# EAGLE design Programmer_HCS (EAGLE 9.5.1)

## Sheet 1 of 2
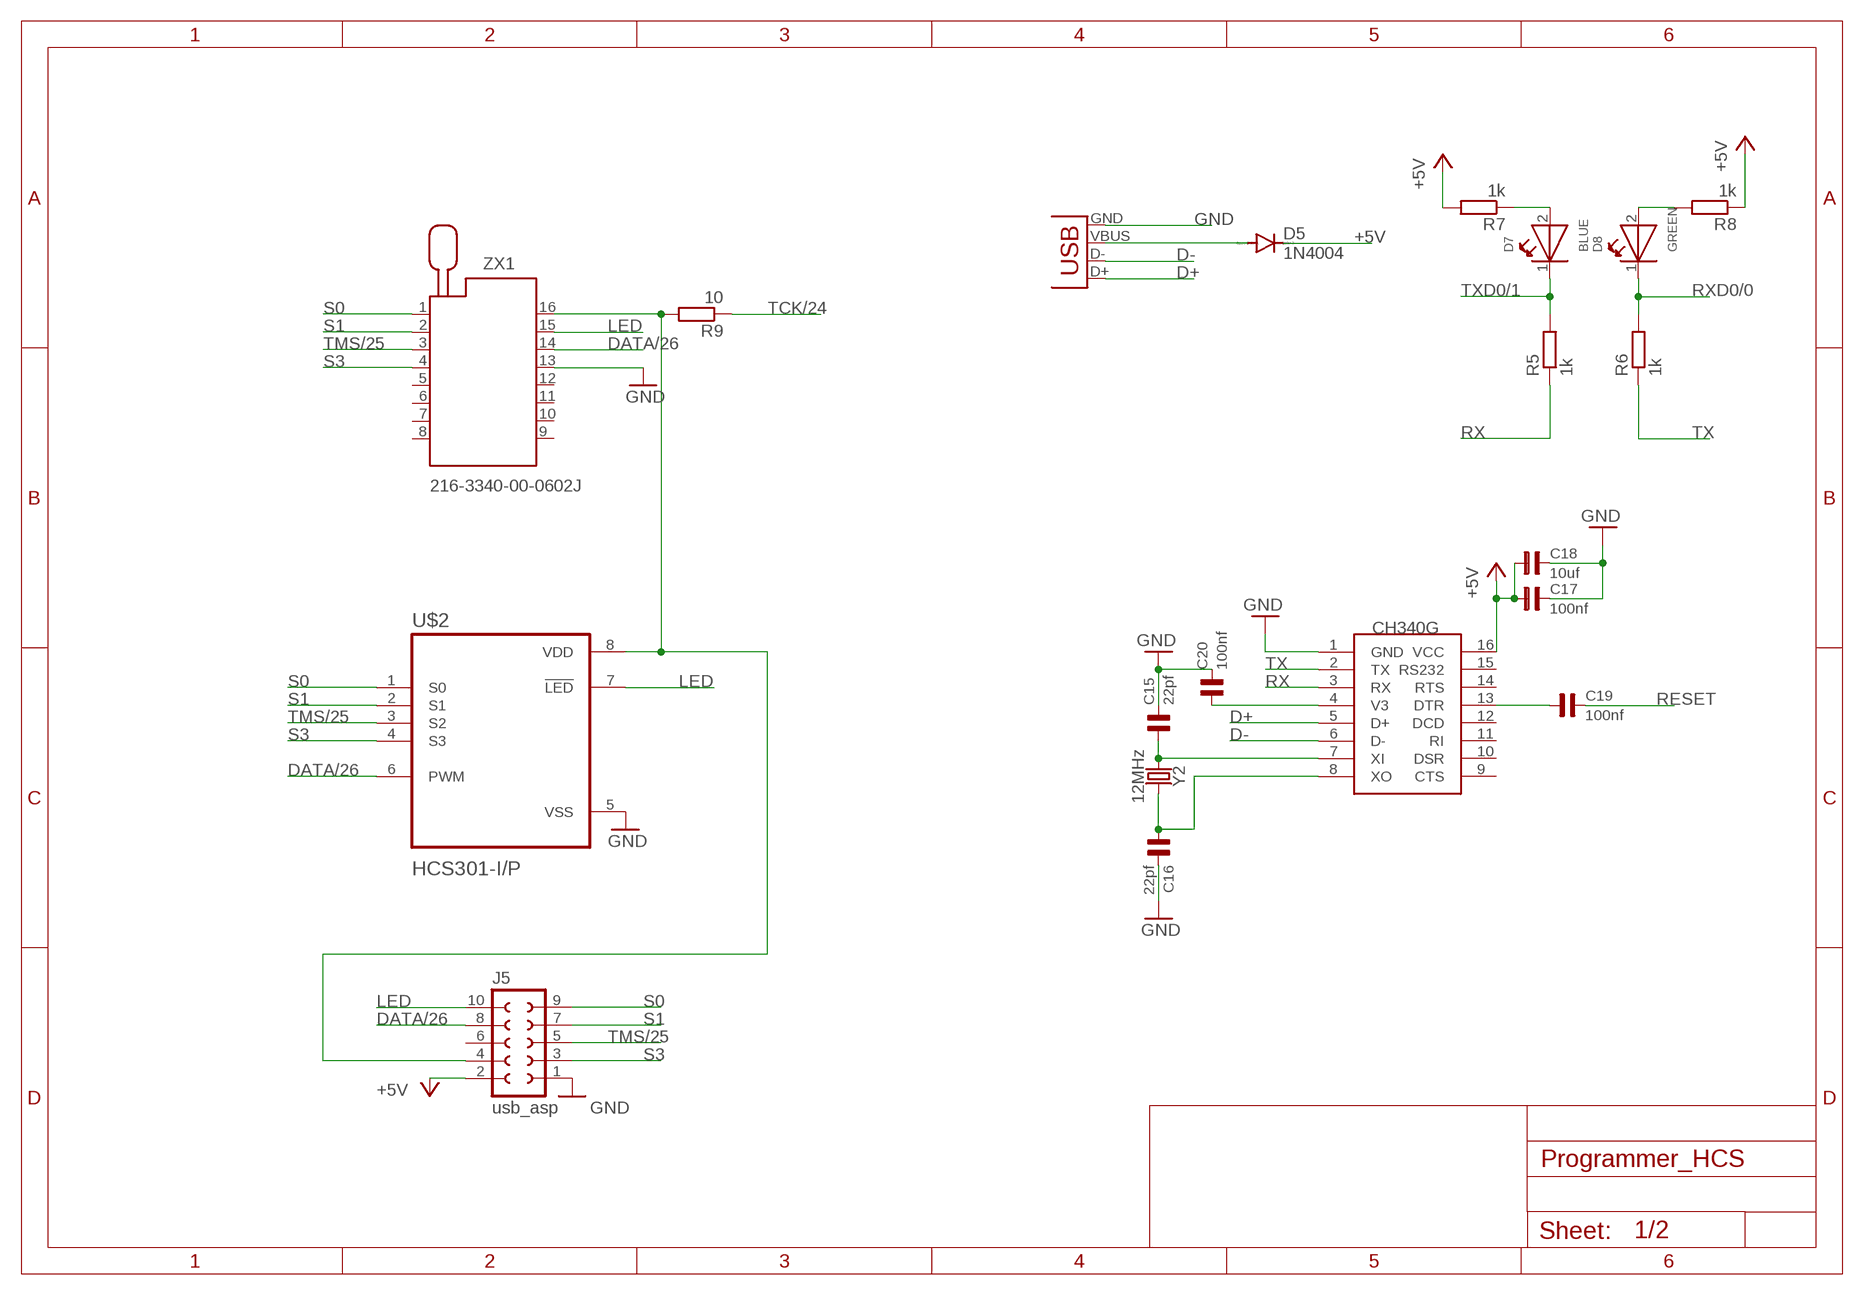
[diagram p0: schematic, sheet 1]

### Parts
C15  22pf  C0805  [0805]
C16  22pf  C0805  [0805]
C17  100nf  C0805  [0805]
C18  10uf  C0805  [0805]
C19  100nf  C0805  [0805]
C20  100nf  C0805  [0805]
D5  1N4004  DIODE-DO214AA  [DO214AA]
D7  BLUE  WL-SMCW-150080RS75000-R  [0805]
D8  GREEN  WL-SMCW-150080RS75000-R  [0805]
J5  usb_asp  SOCKET-10V  [S10V]
R5  1k  R-EU_R0805  [R0805]
R6  1k  R-EU_R0805  [R0805]
R7  1k  R-EU_R0805  [R0805]
R8  1k  R-EU_R0805  [R0805]
R9  10  R-EU_R0805  [R0805]
U$1  CH340G  [SOIC16]
U$2  HCS301-I/P  [DIP787W46P254L927H533Q8]
X1  USB-B-H  [USB-B-H]
Y2  12MHz  CRYSTAL-16MHZPTH-HC49US  [HC49US]
ZX1  216-3340-00-0602J  [216-3340-00-0602J]

### Nets
+5V: C17.1 C18.1 D5.C J5.2 R7.2 R8.1 U$1.16(VCC) ; also sheet 2
D+: U$1.5(D+) X1.D+
D-: U$1.6(D-) X1.D-
DATA/26: J5.8 U$2.6(PWM) ZX1.14 ; also sheet 2
GND: C15.2 C16.2 C17.2 C18.2 C20.2 J5.1 U$1.1(GND) U$2.5(VSS) X1.GND ZX1.13 ; also sheet 2
LED: J5.10 U$2.7(!LED) ZX1.15
N$4: C15.1 U$1.7(XI) Y2.1
N$5: C16.1 U$1.8(XO) Y2.2
N$6: D8.2(A) R8.2
N$7: D5.A X1.VBUS
N$8: C19.1 U$1.13(DTR)
N$9: D7.2(A) R7.1
N$10: C20.1 U$1.4(V3)
N$11: J5.4 R9.2 U$2.8(VDD) ZX1.16
RESET: C19.2 ; also sheet 2
RX: R5.1 U$1.3(RX)
RXD0/0: D8.1(K) R6.2 ; also sheet 2
S0: J5.9 U$2.1(S0) ZX1.1
S1: J5.7 U$2.2(S1) ZX1.2
S3: J5.3 U$2.4(S3) ZX1.4
TCK/24: R9.1 ; also sheet 2
TMS/25: J5.5 U$2.3(S2) ZX1.3 ; also sheet 2
TX: R6.1 U$1.2(TX)
TXD0/1: D7.1(K) R5.2 ; also sheet 2
Unconnected: J5.6 U$1.9(CTS) U$1.10(DSR) U$1.11(RI) U$1.12(DCD) U$1.14(RTS) U$1.15(RS232) ZX1.5 ZX1.6 ZX1.7 ZX1.8 ZX1.9 ZX1.10 ZX1.11 ZX1.12

## Sheet 2 of 2
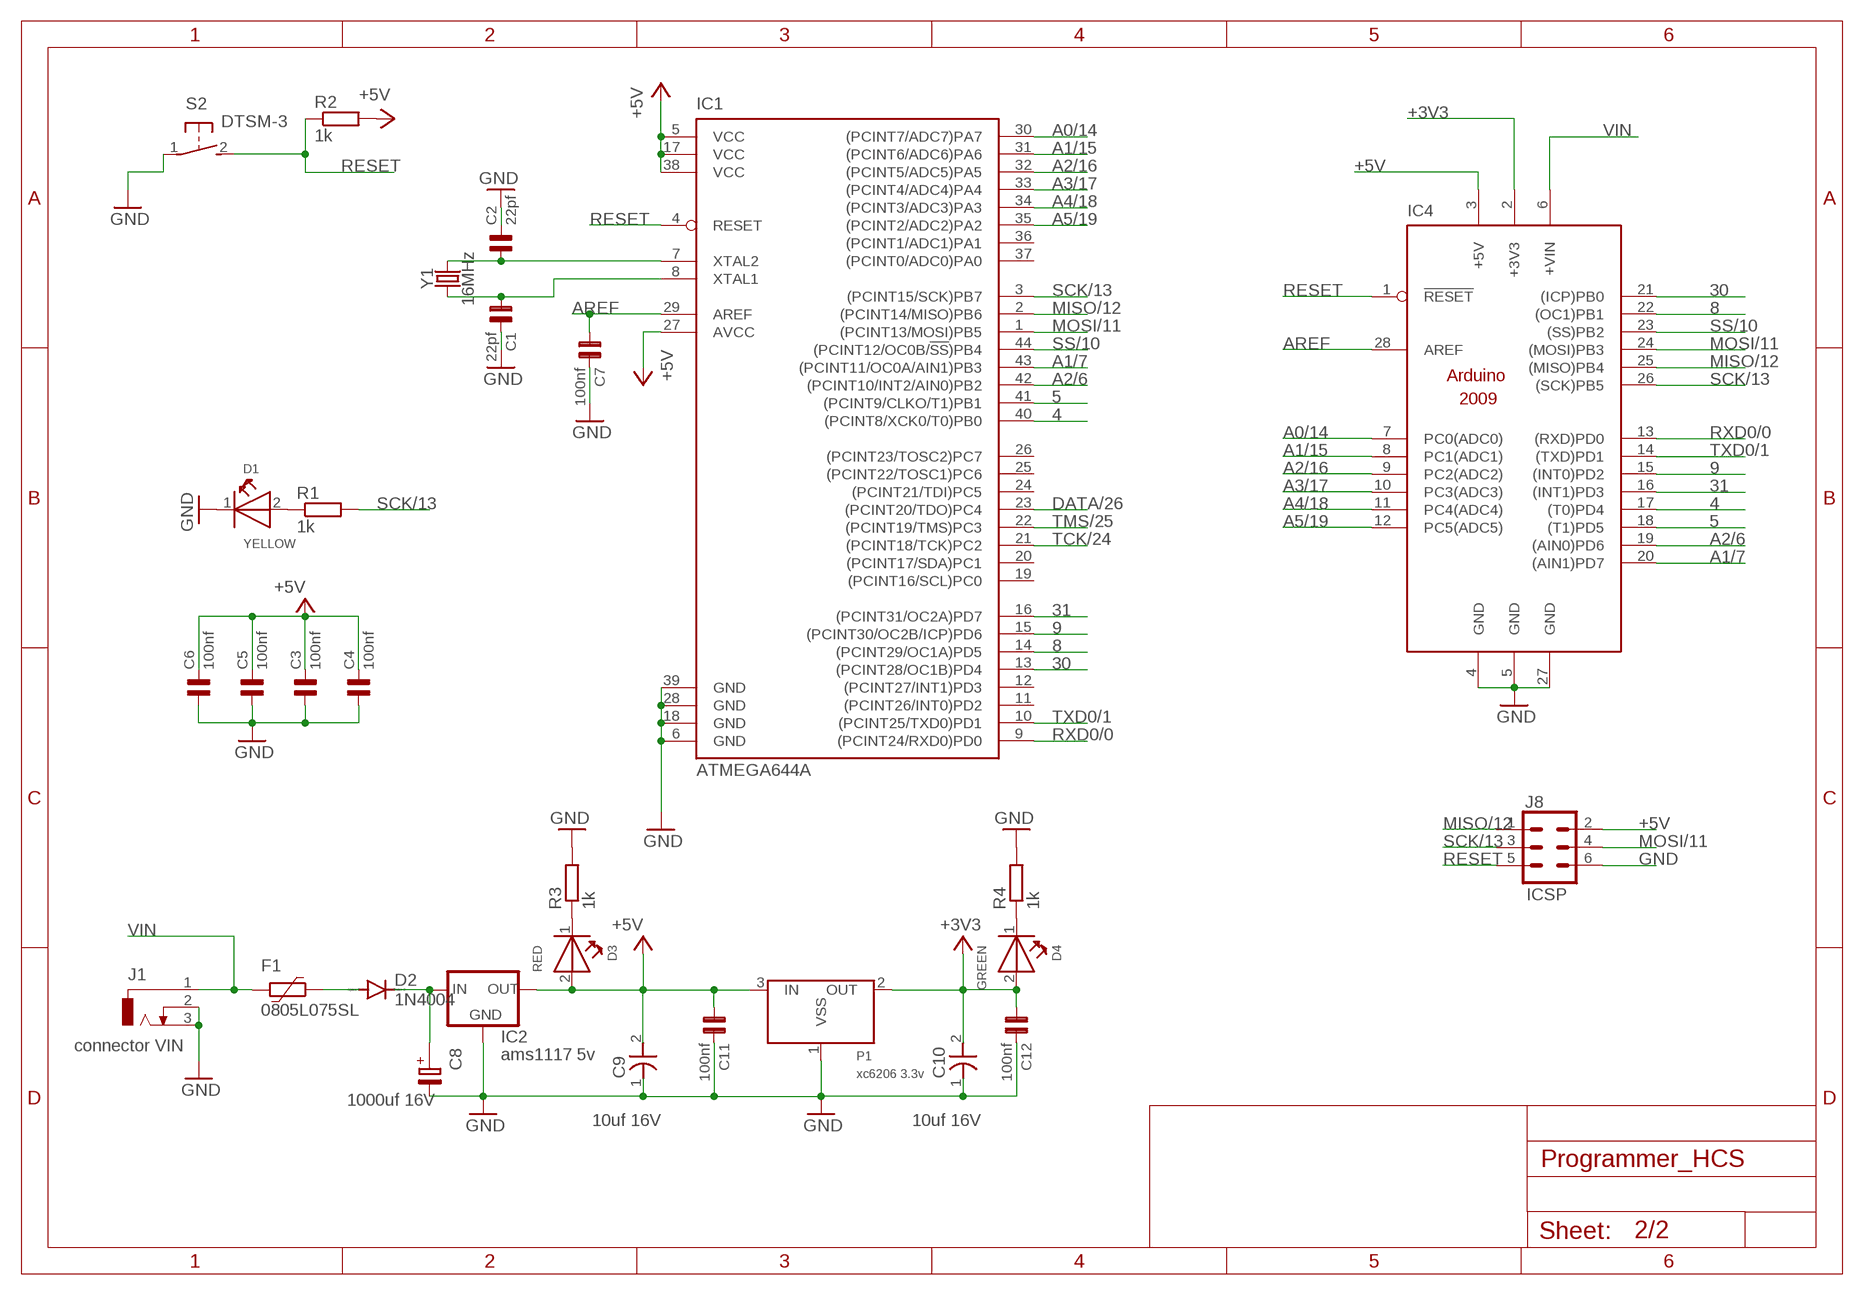
[diagram p1: schematic, sheet 2]

### Parts
C1  22pf  C0805  [0805]
C2  22pf  C0805  [0805]
C3  100nf  C0805  [0805]
C4  100nf  C0805  [0805]
C5  100nf  C0805  [0805]
C6  100nf  C0805  [0805]
C7  100nf  C0805  [0805]
C8  1000uf 16V  C-PR-SMD-SV-G  [SV-G]
C9  10uf 16V  CP6032  [6032]
C10  10uf 16V  CP6032  [6032]
C11  100nf  C0805  [0805]
C12  100nf  C0805  [0805]
D1  YELLOW  WL-SMTW-150141AS73100-A  [3528-2PIN]
D2  1N4004  DIODE-DO-214AC  [DO-214AC]
D3  RED  WL-SMTW-150141AS73100-A  [3528-2PIN]
D4  GREEN  WL-SMTW-150141AS73100-A  [3528-2PIN]
F1  0805L075SL  [0805L]
IC1  ATMEGA644A  [TQFP44]
IC2  ams1117 5v  LM1117  [SOT223]
IC4  UNO  ARDUINO2009_PIN_10  [ARDUINO2009]
J1  connector VIN  DCJ0303  [DCJ0303]
J8  ICSP  CONN_03X2FEMALE  [2X3]
P1  xc6206 3.3v  XC6206SOT-23  [XC6206_SOT-23]
R1  1k  R-EU_R0805  [R0805]
R2  1k  R-EU_R0805  [R0805]
R3  1k  R-EU_R0805  [R0805]
R4  1k  R-EU_R0805  [R0805]
S2  DTSM-3  [DTSM-3]
Y1  16MHz  CRYSTAL-16MHZPTH-HC49US  [HC49US]

### Nets
4: IC1.40((PCINT8/XCK0/T0)PB0) IC4.17((T0)PD4)
5: IC1.41((PCINT9/CLKO/T1)PB1) IC4.18((T1)PD5)
8: IC1.14((PCINT29/OC1A)PD5) IC4.22((OC1)PB1)
9: IC1.15((PCINT30/OC2B/ICP)PD6) IC4.15((INT0)PD2)
30: IC1.13((PCINT28/OC1B)PD4) IC4.21((ICP)PB0)
31: IC1.16((PCINT31/OC2A)PD7) IC4.16((INT1)PD3)
+3V3: C10.2(+) C12.1 D4.2(A) IC4.2(+3V3) P1.2(OUT)
+5V: C3.2 C4.2 C5.2 C6.2 C9.2(+) C11.1 D3.2(A) IC1.5(VCC) IC1.17(VCC) IC1.27(AVCC) IC1.38(VCC) IC2.2(OUT) IC4.3(+5V) J8.2 P1.3(IN) R2.2 ; also sheet 1
A0/14: IC1.30((PCINT7/ADC7)PA7) IC4.7(PC0(ADC0))
A1/7: IC1.43((PCINT11/OC0A/AIN1)PB3) IC4.20((AIN1)PD7)
A1/15: IC1.31((PCINT6/ADC6)PA6) IC4.8(PC1(ADC1))
A2/6: IC1.42((PCINT10/INT2/AIN0)PB2) IC4.19((AIN0)PD6)
A2/16: IC1.32((PCINT5/ADC5)PA5) IC4.9(PC2(ADC2))
A3/17: IC1.33((PCINT4/ADC4)PA4) IC4.10(PC3(ADC3))
A4/18: IC1.34((PCINT3/ADC3)PA3) IC4.11(PC4(ADC4))
A5/19: IC1.35((PCINT2/ADC2)PA2) IC4.12(PC5(ADC5))
AREF: C7.1 IC1.29(AREF) IC4.28(AREF)
DATA/26: IC1.23((PCINT20/TDO)PC4) ; also sheet 1
GND: C1.2 C2.2 C3.1 C4.1 C5.1 C6.1 C7.2 C8.- C9.1(-) C10.1(-) C11.2 C12.2 D1.1(K) IC1.6(GND) IC1.18(GND) IC1.28(GND) IC1.39(GND) IC2.1(GND) IC4.4(GND) IC4.5(GND) IC4.27(GND) J1.2 J1.3 J8.6 P1.1(VSS) R3.2 R4.2 S2.1 ; also sheet 1
MISO/12: IC1.2((PCINT14/MISO)PB6) IC4.25((MISO)PB4) J8.1
MOSI/11: IC1.1((PCINT13/MOSI)PB5) IC4.24((MOSI)PB3) J8.4
N$1: C2.1 IC1.7(XTAL2) Y1.2
N$2: C1.1 IC1.8(XTAL1) Y1.1
N$3: D1.2(A) R1.1
N$24: C8.+ D2.C IC2.3(IN)
N$44: D3.1(K) R3.1
N$45: D2.A F1.1
N$46: D4.1(K) R4.1
RESET: IC1.4(RESET) IC4.1(!RESET) J8.5 R2.1 S2.2 ; also sheet 1
RXD0/0: IC1.9((PCINT24/RXD0)PD0) IC4.13((RXD)PD0) ; also sheet 1
SCK/13: IC1.3((PCINT15/SCK)PB7) IC4.26((SCK)PB5) J8.3 R1.2
SS/10: IC1.44((PCINT12/OC0B/!SS!)PB4) IC4.23((SS)PB2)
TCK/24: IC1.21((PCINT18/TCK)PC2) ; also sheet 1
TMS/25: IC1.22((PCINT19/TMS)PC3) ; also sheet 1
TXD0/1: IC1.10((PCINT25/TXD0)PD1) IC4.14((TXD)PD1) ; also sheet 1
VIN: F1.2 IC4.6(+VIN) J1.1
Unconnected: IC1.11((PCINT26/INT0)PD2) IC1.12((PCINT27/INT1)PD3) IC1.19((PCINT16/SCL)PC0) IC1.20((PCINT17/SDA)PC1) IC1.24((PCINT21/TDI)PC5) IC1.25((PCINT22/TOSC1)PC6) IC1.26((PCINT23/TOSC2)PC7) IC1.36((PCINT1/ADC1)PA1) IC1.37((PCINT0/ADC0)PA0)

## Library data of the parts
C1-C7 C11 C12 C15-C20 = capsmd:C0805
C8 = cap-pan40:C-PR: POLARIZED ELECTROLYTIC/TANTALUM
C9 C10 = capsmd:CP6032
D1 D3 D4 = Wurth_Elektronik_Optoelectronics_rev15b(1):WL-SMTW: SMD Side view mono-color round Characteristics Low power consumption High reliability Low current requirement No UV/IR radiation Wide viewing angle Excelllent for edge lighting displays and backlighting indicators Ideal for miniature applications PBC high-usage Compatible with automatic placement equipment Applications Backlighting for LCD Sidelighting applications Indicator and backlighting for telecommunication Backlighting for symbol, switch and dashboard General use <http://katalog.we-online.de/media/images/eipal/WL-SMTW_pf2.jpg> Details see: http://katalog.we-online.de/en/led/WL-SMTW?m Updated: 2015-04-10 2015 (C) Wurth Elektronik; COMPANY-URL: http://www.we-online.de; CREATED-BY: Christin Otto; CREATED-DATE: APR 2013; DATASHEET-URL: http://katalog.we-online.de/en/led/WL-SMTW?m=t&sq=smtw&sp=&sp=http%3A%2F%2Fwww.we-online.de%2Fweb%2Fen%2Felectronic_components%2Fsearchpage_PBS.php%3Fsearch%3Dsmtw; MANUFACTURER: Würth Elektronik eiSos GmbH
D2 D5 = diode:DIODE-: DIODE
D7 D8 = Wurth_Elektronik_Optoelectronics_rev15b(1):WL-SMCW: SMD mono-color Chip LED Characteristics Low energy consumption High reliability Low current requirement Fast switching No UV/IR radiation Smallest SMD package with exceptional brightness Top view Wide viewing angle PBC high-usage Applications Backlight for mobile and portable device keypads Indoor and outdoor message boards Flat backlight for LCDs, switches and symbols Display for industrial control systems and traffic Miniaturized color effects Pedestrian mark Optical indicators General lighting Toys <http://katalog.we-online.de/media/images/eipal/WL-SMCW_pf2.jpg> Details see: http://katalog.we-online.de/en/led/WL-SMCW?m Updated 2015-04-10 2015 (C) Wurth Elektronik; COMPANY-URL: http://www.we-online.de; CREATED-BY: Christin Otto; CREATED-DATE: APR 2013; DATASHEET-URL: http://katalog.we-online.de/en/led/WL-SMCW?m=t&sq=smcw&sp=&sp=http%3A%2F%2Fwww.we-online.de%2Fweb%2Fen%2Felectronic_components%2Fsearchpage_PBS.php%3Fsearch%3Dsmcw#vs_t2:2; MANUFACTURER: Würth Elektronik eiSos GmbH
F1 = polyfuse-smd_10:?: Polyfuse Resettable PTC Source: http://www.littelfuse.com/products/resettable-ptcs.aspx; MF: Littelfuse; MPN: 0805L075SL; OC_FARNELL: 2125905; OC_NEWARK: 88T7684
IC1 = atmel:ATMEGA644: 8-bit Microcontroller with 64K Bytes In-System Programmable Flash Source: http://www.atmel.com/dyn/resources/prod_documents/doc2593.pdf; MPN: ATMEGA644PV-10AU; OC_FARNELL: 1455123; OC_NEWARK: 58M3748
IC2 = v-reg-2:LM1117
IC4 = arduino:ARDUINO2009_PIN_1: The Arduino Duemilanove ("2009") is a microcontroller board based on the ATmega168 or ATmega328. - 14 digital input/output pins (of which 6 can be used as PWM outputs) - 6 analog inputs, a 16 MHz crystal oscillator - USB connection - power jack - ISP header - reset button It contains everything needed to support the microcontroller; simply connect it to a computer with a USB cable or power it with a AC-to-DC adapter or battery to get started http://arduino.cc/en/Main/ArduinoBoardDuemilanove
J1 = con-jack:DCJ0303: DC POWER JACK Source: DCJ0303.pdf; OC_FARNELL: unknown; OC_NEWARK: unknown
J5 = con-3m-skt-header:SOCKET-10: 10 pin PCB Socket (3m 85xx/51xx)
J8 = SparkFun-Connectors:CONN_03X2: Multi connection point. Often used as Generic Header-pin footprint for 0.1 inch spaced/style header connections You can populate with any combo of single row headers, but if you'd like an exact match, check these: Header - 2x3 (Male, 0.1") <https://www.sparkfun.com/products/12807> (PRT-12807) Header - 2x3 (Female, 0.1") <https://www.sparkfun.com/products/13010> (PRT-13010) 2x3 Pin Shrouded Header <https://www.sparkfun.com/products/10877> (PRT-10877) On any of the 0.1 inch spaced packages, you can populate with these: Break Away Headers - Straight <https://www.sparkfun.com/products/116> (PRT-00116) Break Away Male Headers - Right Angle <https://www.sparkfun.com/products/553> (PRT-00553) Female Headers <https://www.sparkfun.com/products/115> (PRT-00115) Break Away Headers - Machine Pin <https://www.sparkfun.com/products/117> (PRT-00117) Break Away Female Headers - Swiss Machine Pin <https://www.sparkfun.com/products/743> (PRT-00743) Special note: the shrouded connector mates well with our 3x2 ribbon cables: Ribbon Crimp Connector - 6-pin (2x3, Female) <https://www.sparkfun.com/products/10651> (PRT-10651) Ribbon Cable - 6 wire (15ft) <https://www.sparkfun.com/products/10646> (PRT-10646); PROD_ID: CONN-11566; VALUE: FEMALE 2x3
P1 = Voltage Regulator:XC6206: XC6206P , linear regulator. Producted by TOREX.Co Store Information: EXCEL device corporation http://www.excel-d.com/access/index.html
R1-R9 = resistor:R-EU_: RESISTOR, European symbol
S2 = switch-tact:DTSM-3
U$1 = ch340g:CH340G
U$2 = HCS301-I_P:HCS301-I/P: Check prices <https://pricing.snapeda.com/parts/HCS301-I/P/Microchip/view-part?ref=eda>; AVAILABILITY: Warning; DESCRIPTION: IC CODE HOPPING ENCODER 8DIP; MF: Microchip; MP: HCS301-I/P; PACKAGE: DIP-8 Microchip; PRICE: None; PURCHASE-URL: https://pricing.snapeda.com/search/part/HCS301-I/P/?ref=eda
X1 = con-usb:USB: USB Connectors
Y1 = SparkFun-Clocks:CRYSTAL-16MHZ: 16MHz Crystal Digikey Example <http://www.digikey.com/product-search/en?keywords=535-9122-1-ND> Frequency: 16MHz Frequency Stability: ±50ppm Frequency Tolerance: ±20ppm Load Capacitance: 18pF SparkFun Products: Pro Micro -5V/16MHz <https://www.sparkfun.com/products/12640> SparkFun Serial Enabled LCD Kit <https://www.sparkfun.com/products/10097>; PROD_ID: XTAL-08181; SF_ID: COM-00536
Y2 = SparkFun-Clocks:CRYSTAL-16MHZ: 16MHz Crystal Digikey Example <http://www.digikey.com/product-search/en?keywords=535-9122-1-ND> Frequency: 16MHz Frequency Stability: ±50ppm Frequency Tolerance: ±20ppm Load Capacitance: 18pF SparkFun Products: Pro Micro -5V/16MHz <https://www.sparkfun.com/products/12640> SparkFun Serial Enabled LCD Kit <https://www.sparkfun.com/products/10097>; PROD_ID: XTAL-08181; SF_ID: COM-00536; VALUE: 16MHz
ZX1 = 216-3340-00-0602J:216-3340-00-0602J: Zero Insertion Force Socked Source: http://www.3M.com/ehpd Check prices <https://pricing.snapeda.com/parts/216-3340-00-0602J/3M/view-part?ref=eda>; AVAILABILITY: Warning; DESCRIPTION: 16 (2 x 8) Pos DIP, ZIF (ZIP), 0.3 (7.62mm) Row Spacing Socket Gold Connector; MF: 3M; MP: 216-3340-00-0602J; PACKAGE: None; PRICE: None; PURCHASE-URL: https://pricing.snapeda.com/search/part/216-3340-00-0602J/?ref=eda

## Board
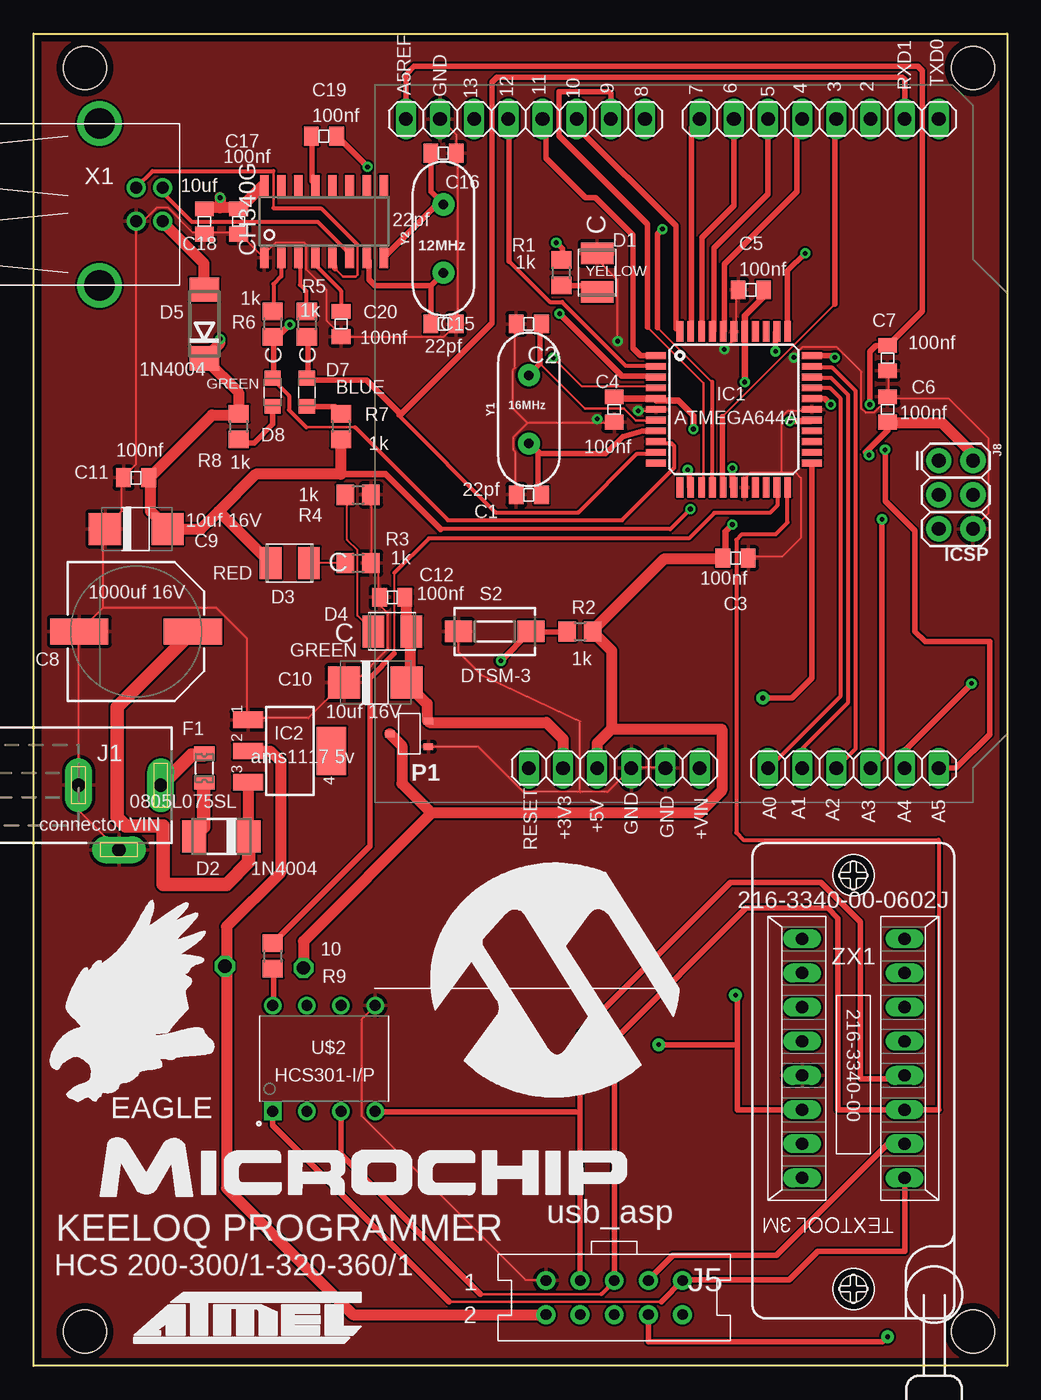
[diagram p2: board, top side]
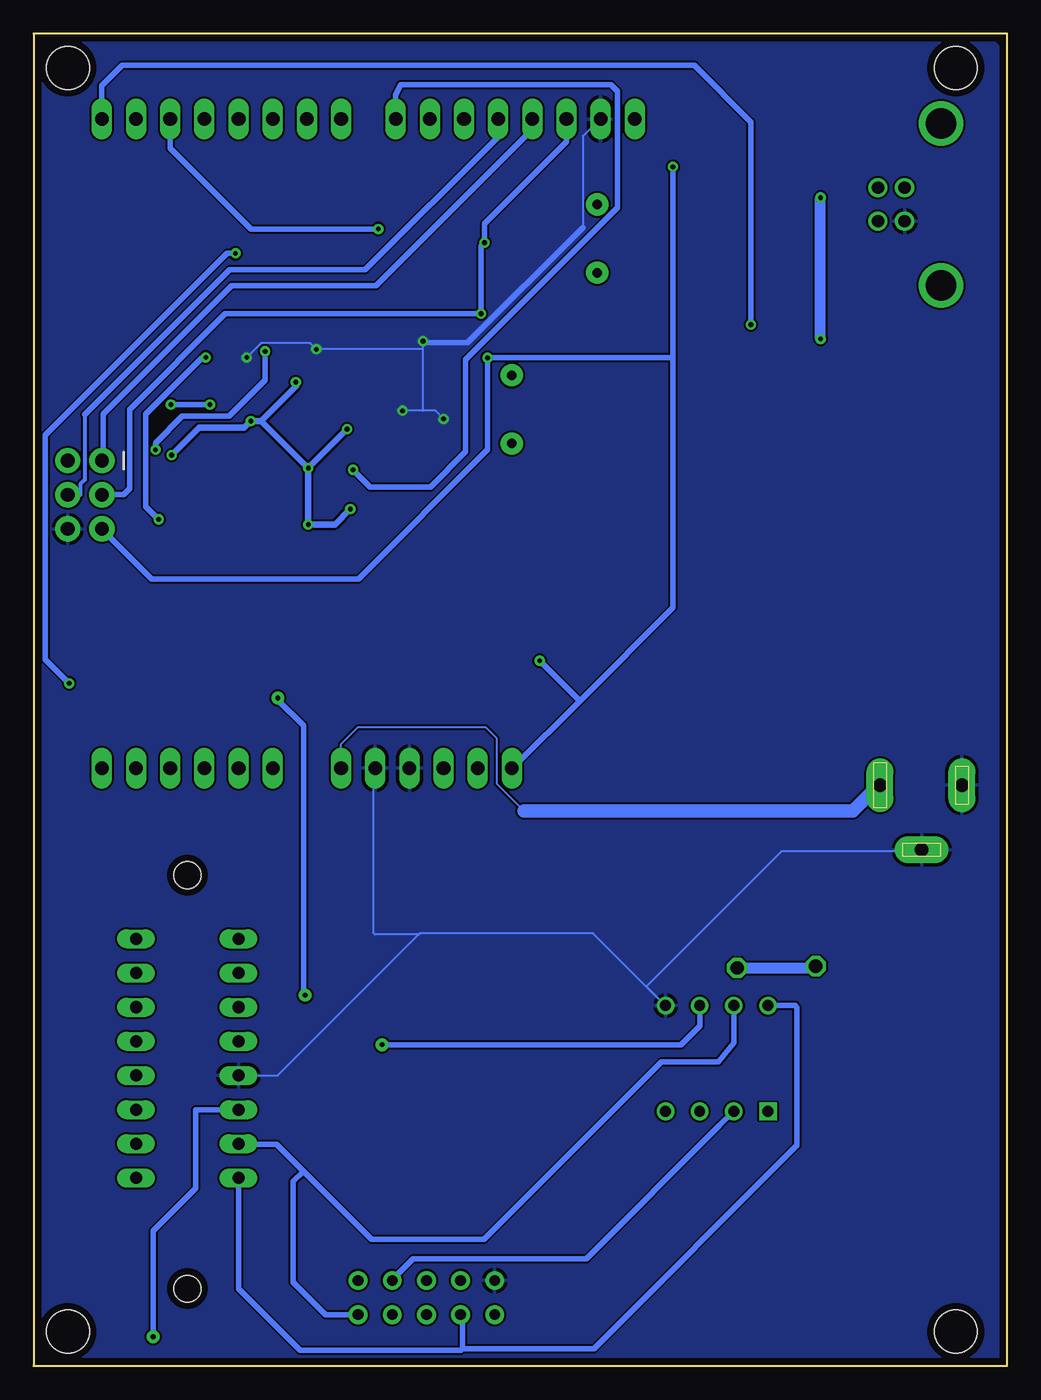
[diagram p3: board, bottom side, seen from below]

Size 72.39 x 99.06 mm. Coordinates in mm from the lower left corner, seen from the top.
Outline: 0,0 0,99.06 72.39,99.06 72.39,0 0,0
Copper layers (1*16): Top 0.035mm / dielectric 1.5mm / Bottom 0.035mm
Design rules "default *": minimum track width 6mil, minimum drill 0.35mm, track to track 6mil, track to pad 6mil, pad to pad 6mil, via to via 6mil, smd to smd 6mil, copper to edge 20mil, drill to drill 6mil, minimum pad ring 10mil, minimum via ring 8mil, stop-mask expansion 4mil, vias tented up to drill 0mil, thermal gap 10mil
Holes 3.2 mm at 3.81,2.54 69.85,2.54 69.85,96.52 3.81,96.52

### Footprints (pad centres in the part's own frame; a part is rotated, then mirrored left to right if it is on the bottom)
0805 = smd 1.092 x 1.397: 1 -0.94,0; 2 0.94,0
SV-G = smd 4.318 x 1.93: + -4.223,0; - 4.223,0
6032 = smd 2.388 x 2.388: 1 -2.311,0; 2 2.337,0
3528-2PIN = smd 1.6 x 2.4: 1 -1.425,0; 2 1.425,0
DO-214AC = smd 1.8 x 2.4: A 2.025,0; C -2.025,0
DO214AA = smd 1.8 x 2.2: A 2.55,0; C -2.55,0
0805' = smd 1.1 x 1.2: 1 -1.05,0; 2 1.05,0
0805L = smd 1 x 1.5: 1 -1.1,0; 2 1.1,0
TQFP44 = smd 1.5 x 0.5: 1 -5.8,4; 2 -5.8,3.2; 3 -5.8,2.4; 4 -5.8,1.6; 5 -5.8,0.8; 6 -5.8,0; 7 -5.8,-0.8; 8 -5.8,-1.6; 9 -5.8,-2.4; 10 -5.8,-3.2; 11 -5.8,-4; 23 5.8,-4; 24 5.8,-3.2; 25 5.8,-2.4; 26 5.8,-1.6; 27 5.8,-0.8; 28 5.8,0; 29 5.8,0.8; 30 5.8,1.6; 31 5.8,2.4; 32 5.8,3.2; 33 5.8,4 | smd 0.5 x 1.5: 12 -4,-5.8; 13 -3.2,-5.8; 14 -2.4,-5.8; 15 -1.6,-5.8; 16 -0.8,-5.8; 17 0,-5.8; 18 0.8,-5.8; 19 1.6,-5.8; 20 2.4,-5.8; 21 3.2,-5.8; 22 4,-5.8; 34 4,5.8; 35 3.2,5.8; 36 2.4,5.8; 37 1.6,5.8; 38 0.8,5.8; 39 0,5.8; 40 -0.8,5.8; 41 -1.6,5.8; 42 -2.4,5.8; 43 -3.2,5.8; 44 -4,5.8
SOT223 = smd 1.219 x 2.235: 1 -2.311,-3.099; 2 0,-3.099; 3 2.311,-3.099 | smd 3.6 x 2.2: 4 0,3.099
ARDUINO2009 = drill 1.016 long: 1 11.43,2.54; 2 13.97,2.54; 3 16.51,2.54; 4 19.05,2.54; 5 21.59,2.54; 6 24.13,2.54; 7 29.21,2.54; 8 31.75,2.54; 9 34.29,2.54; 10 36.83,2.54; 11 39.37,2.54; 12 41.91,2.54; 13 41.91,50.8; 14 39.37,50.8; 15 36.83,50.8; 16 34.29,50.8; 17 31.75,50.8; 18 29.21,50.8; 19 26.67,50.8; 20 24.13,50.8; 21 20.066,50.8; 22 17.526,50.8; 23 14.986,50.8; 24 12.446,50.8; 25 9.906,50.8; 26 7.366,50.8; 27 4.826,50.8; 28 2.286,50.8
DCJ0303 = drill 1 pad 2 long: 1 0,3.1; 2 4.8,0; 3 0,-3
S10V = drill 0.8 pad 1.4: 1 5.08,-1.27; 2 5.08,1.27; 3 2.54,-1.27; 4 2.54,1.27; 5 0,-1.27; 6 0,1.27; 7 -2.54,-1.27; 8 -2.54,1.27; 9 -5.08,-1.27; 10 -5.08,1.27
2X3 = drill 1.016 pad 1.88: 1 0,0; 2 0,2.54; 3 2.54,0; 4 2.54,2.54; 5 5.08,0; 6 5.08,2.54
XC6206_SOT-23 = smd 0.5 x 0.7: 1 -0.95,-1.415; 2 0.95,-1.415; 3 0,1.44
R0805 = smd 1.3 x 1.5: 1 -0.95,0; 2 0.95,0
DTSM-3 = smd 2 x 1.6: 1 -2.7,0; 2 2.7,0
SOIC16 = smd 0.635 x 1.524: 1 -4.445,-2.695; 2 -3.175,-2.695; 3 -1.905,-2.695; 4 -0.635,-2.695; 5 0.635,-2.695; 6 1.905,-2.695; 7 3.175,-2.695; 8 4.445,-2.695; 9 4.445,2.695; 10 3.175,2.695; 11 1.905,2.695; 12 0.635,2.695; 13 -0.635,2.695; 14 -1.905,2.695; 15 -3.175,2.695; 16 -4.445,2.695
DIP787W46P254L927H533Q8 = drill 0.8 square: 1 -3.935,3.81 | drill 0.8: 2 -3.935,1.27; 3 -3.935,-1.27; 4 -3.935,-3.81; 5 3.935,-3.81; 6 3.935,-1.27; 7 3.935,1.27; 8 3.935,3.81
USB-B-H = drill 0.914: D+ 0,1.25; D- 1.981,1.25; GND 0,-1.25; VBUS 1.981,-1.25 | drill 2.286: P$1 -2.718,-6.02; P$2 -2.718,6.02
HC49US = drill 0.7 pad 1.651: 1 -2.54,0; 2 2.54,0
216-3340-00-0602J = drill 0.9 long: 1 -8.89,-3.81; 2 -6.35,-3.81; 3 -3.81,-3.81; 4 -1.27,-3.81; 5 1.27,-3.81; 6 3.81,-3.81; 7 6.35,-3.81; 8 8.89,-3.81; 9 8.89,3.81; 10 6.35,3.81; 11 3.81,3.81; 12 1.27,3.81; 13 -1.27,3.81; 14 -3.81,3.81; 15 -6.35,3.81; 16 -8.89,3.81 | hole 2: 13.62,0; -17.12,0

### Placement (x,y rotation side)
C1  36.83,64.77 180 top
C2  36.83,77.47 180 top
C3  52.2,60.07 180 top
C4  43.18,71.12 90 top
C5  53.34,80.01 0 top
C6  63.5,71.12 270 top
C7  63.5,74.93 270 top
C8  7.62,54.61 180 top
C9  7.62,62.23 0 top
C10  25.4,50.8 0 top
C11  7.62,66.04 180 top
C12  26.67,57.15 180 top
C15  30.48,77.47 0 top
C16  30.48,90.17 0 top
C17  15.24,85.09 270 top
C18  12.7,85.09 270 top
C19  21.59,91.44 0 top
C20  22.86,77.47 270 top
D1  41.91,81.28 270 top
D2  13.97,39.37 180 top
D3  19.05,59.69 180 top
D4  26.67,54.61 0 top
D5  12.7,77.47 90 top
D7  BLUE  [0805']  20.32,72.39 270 top
D8  GREEN  [0805']  17.78,72.39 270 top
F1  12.7,44.45 90 top
IC1  52.07,71.12 0 top
IC2  19.05,45.72 270 top
IC4  25.4,41.91 0 top
J1  6.35,43.18 270 top
J5  43.18,5.08 180 top
J8  67.31,67.31 270 top
P1  27.94,46.99 90 top
R1  39.24,81.28 90 top
R2  40.64,54.61 0 top
R3  24.13,59.69 0 top
R4  24.13,64.77 0 top
R5  20.32,77.47 270 top
R6  17.78,77.47 270 top
R7  22.86,69.85 270 top
R8  15.24,69.85 270 top
R9  17.78,30.48 270 top
S2  34.29,54.61 0 top
U$1  21.59,85.09 0 top
U$2  21.59,22.86 90 top
X1  7.62,86.36 0 top
Y1  36.83,71.12 90 top
Y2  30.48,83.82 90 top
ZX1  60.96,22.86 90 top

### Tracks (layer width: path | path; a pad name or v marks a point on that pad's centre or on a via)
4
  Top 0.152: 51.36,76.96 IC1.40
  Top 0.4: 51.36,76.96 51.36,81.92 56.77,87.33 56.77,92.33 IC4.17
5
  Top 0.152: 50.6,76.96 IC1.41
  Top 0.4: 50.6,76.96 50.6,83.11 54.61,87.12 IC4.18
8
  Top 0.152: 49.81,65.99 IC1.14
  Top 0.2: 49.81,65.99 49.81,73.08 45.64,77.24
  Top 0.4: 45.64,77.24 45.64,84.89 39.06,91.47 39.06,94.74 42.8,94.74 42.93,94.61 IC4.22
9  (via drill 0.35)
  Top 0.152: 50.44,65.38 IC1.15
  Top 0.2: 46.38,77.22 50.44,73.15
  Top 0.3: 50.44,73.15 50.44,65.38
  Top 0.4: v46.76,84.53 46.38,84.15 46.38,77.22
  Bottom 0.4: v46.76,84.53 56.21,84.53 62.23,90.55 IC4.15
30  (via drill 0.35)
  Top 0.152: 48.77,65.38 IC1.13
  Top 0.4: 48.77,65.38 48.77,66.5 v48.64,66.62
  Bottom 0.4: v48.64,66.62 47.37,65.35 42.88,65.35 40.26,67.97 40.26,74.83 28.98,86.11 28.98,94.77 29.46,95.25 45.09,95.25 45.47,94.49 IC4.21
31
  Top 0.152: IC1.16 51.23,65.36 | 59.59,92.66 IC4.16
  Top 0.2: 59.59,78.94 51.23,70.59
  Top 0.4: 51.23,70.59 51.23,65.36 | 59.59,92.66 59.59,78.94
+3V3
  Top 0.152: 27.74,55.02 28.04,54.71 D4.2 28.04,54.56 | 27.74,57.15 C12.1 | 29.26,48.01 P1.2 29.41,47.85 | 27.74,50.75 C10.2 27.74,50.9 28.04,51.21
  Top 0.8: 27.74,55.02 27.74,57.15 | 29.26,48.01 29.26,49.23 27.74,50.75 | 28.04,51.21 28.04,54.56 | IC4.2 39.37,46.61 38.12,47.85 29.41,47.85
+5V  (via drill 0.35, 1)
  Top 0.152: 29.59,41.1 29.4,41.29 | 12.8,86.11 C18.1 | 15.24,86.11 C17.1 15.24,85.95 | 17.07,87.78 U$1.16 | 12.8,74.83 D5.C 12.8,74.98 | 13.87,76.05 v13.87,76.35 | 8.69,65.99 C11.1 8.69,66.14 | 9.91,62.33 C9.2 10.06,62.18 | 13.79,63.52 13.74,63.52 | 15.24,70.71 R8.1 | 63.55,70.1 C6.2 | 52.88,76.96 IC1.38 52.88,76.81 | 43.28,71.93 C4.2 | 46.18,71.93 IC1.5 46.33,71.78 | 41.6,54.71 R2.2 41.6,54.56 | 51.97,65.38 IC1.17 | 51.33,60.07 C3.2 | 57.76,70.26 IC1.27 | v14.22,29.72 14.35,29.84
  Top 0.3: 30.28,62.2 47.35,62.2 v48.84,63.7
  Top 0.5: C5.2 54.28,79.48 52.88,78.08 52.88,76.96 | 46.18,71.93 43.28,71.93 | v51.97,66.75 51.97,65.38 | 51.46,60.2 51.46,62.05 v51.97,62.56 | v56.24,70.26 57.76,70.26 | 46.33,71.78 47.95,71.78 49.07,70.66 v49.07,69.65 | v52.88,73.15 52.88,76.81 | C6.2 63.5,69.55 61.9,67.94 v62.13,67.72 | 22.86,66.29 26.19,66.29 30.28,62.2
  Top 0.8: 29.4,41.29 27.39,43.3 27.39,46.1 P1.3 | 42.98,47.35 51.18,47.35 51.18,42.77 49.51,41.1 29.59,41.1 20.07,31.57 v20.07,29.59 | 42.98,47.35 41.91,46.28 IC4.3 | IC2.2 17.6,45.72 18.39,44.93 18.39,36.7 14.35,32.66 14.35,29.84 14.35,13.21 23.75,3.81 J5.2 | 15.24,86.11 13.87,86.11 | 13.87,86.11 12.8,86.11 | 15.24,85.95 17.07,87.78 | R8.1 15.24,72.39 12.8,74.83 | v13.87,86.87 13.87,86.11 | 12.8,74.98 13.87,76.05 | 8.69,65.99 8.69,63.55 9.91,62.33 | R7.2 22.86,66.29 16.51,66.29 13.74,63.52 12.39,62.18 10.06,62.18 | D3.2 13.79,63.52 | 15.24,70.71 13.26,70.71 8.69,66.14 | 63.55,70.1 67.56,70.1 69.85,67.82 J8.2 | 41.6,54.71 46.91,60.02 51.18,60.02 C3.2 | 51.33,60.07 51.46,60.2 | 42.98,47.35 42.98,53.19 41.6,54.56
  Bottom 0.152: 52.88,72.85 v52.88,73.15 | 14.35,29.59 v14.22,29.72
  Bottom 0.5: v51.97,66.75 v51.97,62.56 49.99,62.56 v48.84,63.7 | 55.47,70.26 v56.24,70.26 56.74,69.75 60.1,69.75 v62.13,67.72 | v51.97,66.75 55.47,70.26 | v51.97,66.75 v49.07,69.65 | 55.47,70.26 52.88,72.85
  Bottom 0.8: v13.87,76.35 v13.87,86.87 | v20.07,29.59 14.35,29.59
A0/14
  Top 0.152: 57.91,72.69 IC1.30 | 54.71,44.5 IC4.7
  Top 0.3: 57.91,72.69 59.23,72.69 60.02,71.91 60.02,49.81 54.71,44.5
A1/7
  Top 0.152: 48.92,76.96 IC1.43 | 49.53,92.66 IC4.20
  Top 0.4: 48.92,76.96 48.92,92.05 49.53,92.66
A1/15
  Top 0.152: 57.91,73.46 IC1.31
  Top 0.3: 57.91,73.46 59.31,73.46 60.58,72.19 60.58,49.33 57.15,45.9 IC4.8
A2/6
  Top 0.152: 49.68,76.96 IC1.42
  Top 0.4: 49.68,76.96 49.68,83.9 52.07,86.28 IC4.19
A2/16
  Top 0.152: 57.91,74.22 IC1.32
  Top 0.3: 57.91,74.22 59.41,74.22 61.14,72.49 61.14,45.9 IC4.9
A3/17  (via drill 0.35)
  Top 0.152: 57.87,75.11 IC1.33 | 62.33,44.5 IC4.10
  Top 0.4: v59.59,74.98 59.46,75.11 57.87,75.11 | v63.09,62.94 63.09,45.26 62.33,44.5
  Bottom 0.152: 59.84,74.98 v59.59,74.98
  Bottom 0.4: 59.84,74.98 64.06,70.76 64.06,63.91 v63.09,62.94
A4/18  (via drill 0.35)
  Top 0.4: v57.38,82.73 56.07,81.42 IC1.34 | v69.75,50.75 64.77,45.77 IC4.11
  Bottom 0.4: v57.38,82.73 58.01,82.73 71.53,69.22 71.53,52.53 v69.75,50.75
A5/19  (via drill 0.35)
  Top 0.152: 55.17,76.81 IC1.35
  Top 0.4: v55.17,75.44 55.17,76.81 | v63.32,68.12 63.32,64.31 65.53,62.1 65.53,54.61 66.29,53.85 71.09,53.85 71.09,46.97 68.58,44.45 IC4.12
  Bottom 0.4: v55.17,75.44 55.17,73.28 57.84,70.61 61.34,70.61 63.32,68.63 v63.32,68.12
AREF  (via drill 0.35)
  Top 0.152: 57.87,71.91 IC1.29 | 63.55,75.89 C7.1
  Top 0.4: C7.1 62.64,75.87 62.18,75.41 v62.18,71.48 | v59.28,71.48 58.85,71.91 57.87,71.91 | IC4.28 27.69,96.01 28.3,96.62 65.76,96.62 66.09,96.29 66.09,78.44 63.55,75.89
  Bottom 0.4: v59.28,71.48 v62.18,71.48
D+
  Top 0.152: 7.62,87.63 X1.D+
  Top 0.2: 22.43,81.58 23.01,81 23.93,81 24.08,81.15 24.08,83.36 | 17.83,88.85 17.83,86.11
  Top 0.3: 24.08,83.36 21.36,86.08 17.86,86.08 17.83,86.11 | 17.83,88.85 8.84,88.85 7.62,87.63
  Top 0.4: 22.43,81.58 U$1.5
D-
  Top 0.3: U$1.6 23.22,82.98 21.13,85.06 11.76,85.06 9.6,87.22 X1.D-
DATA/26  (via drill 0.35 pad 0.95)
  Top 0.152: 52.07,23.88 52.32,24.13
  Top 0.4: IC1.23 57.87,51.14 56.39,49.66 v54.23,49.66 | ZX1.14 52.32,19.05 52.32,24.13 52.32,27.43 v52.2,27.56 | J5.8 45.72,1.78 63.12,1.78 v63.5,2.16 | v46.48,23.88 52.07,23.88
  Bottom 0.152: v54.23,49.66 54.23,49.53
  Bottom 0.4: 54.23,49.53 52.32,47.62 52.32,27.69 v52.2,27.56 | v63.5,2.16 63.5,10.03 60.33,13.21 60.33,19.05 ZX1.14 | v46.48,23.88 24.26,23.88 22.86,25.27 U$2.6
GND  (via drill 0.35)
  Top 0.152: 40.64,42.67 42.67,42.67 IC4.4 44.5,44.5 46.94,44.5 IC4.5 | 40.64,42.67 36.42,42.67 33.07,46.02 29.41,46.02 P1.1 | 40.64,42.67 40.64,47.93 33.36,51.32 31.59,53.09 S2.1 | 55.63,66.45 53.34,66.45 52.88,65.99 52.88,65.38 IC1.18 | 55.63,66.45 56.64,66.45 57.07,66.02 57.07,61.57 55.68,60.17 53.16,60.17 C3.1 | 56.84,71.02 56.08,71.02 55.63,70.56 55.63,66.45 | 56.84,71.02 57.76,71.02 IC1.28 | C7.2 63.55,73.91 63.55,72.08 C6.1 63.55,71.93 | 63.55,71.93 68.05,71.93 71.02,68.96 71.02,63.4 J8.6 | 56.84,74.98 56.84,75.44 57.15,75.74 59.74,75.74 61.57,73.91 61.57,71.17 61.87,70.87 62.48,70.87 63.55,71.93 | 56.84,74.98 56.84,71.02 | C5.1 52.27,80.01 52.27,77.11 52.12,76.96 IC1.39 51.97,76.81 51.97,76.2 v51.36,75.59 | 36.73,70.1 35.66,69.04 35.66,68.12 35.81,67.97 35.81,64.77 C1.2 | 41.91,70.1 43.13,70.1 C4.1 | 41.91,70.1 36.73,70.1 | 36.73,70.1 35.66,71.17 35.66,74.07 35.81,74.22 35.81,77.42 C2.2 | v44.96,71.02 46.18,71.02 IC1.6 | 41.91,70.1 v41.91,70.41 | D1.1 41.91,82.3 43.43,80.77 v43.43,76.2 | v56.54,74.98 56.84,74.98 | 15.24,84.28 12.8,84.28 C18.2 12.65,84.28 11.84,84.28 10.01,86.11 9.14,86.11 8.23,85.19 7.62,85.19 X1.GND 7.62,67.06 6.71,66.14 C11.2 6.55,65.99 6.55,63.55 5.33,62.33 C9.1 5.18,62.18 5.18,56.39 | 15.24,84.28 17.07,82.45 U$1.1 17.22,82.45 17.22,82.75 17.98,83.52 20.12,83.52 20.27,83.36 | 15.24,84.28 C17.2 | IC4.27 30.33,92.66 31.39,91.59 31.39,90.22 C16.2 31.55,90.07 31.55,77.57 C15.2 31.39,77.42 30.48,76.5 22.86,76.5 C20.2 22.86,76.66 21.79,77.72 21.79,80.01 20.27,81.53 | R4.2 25.15,64.77 25.15,59.74 R3.2 25.15,59.59 25.6,59.13 25.6,57.15 C12.2 25.76,57.15 25.76,56.54 26.36,55.93 26.36,53.34 23.93,50.9 23.16,50.9 C10.1 23.01,50.75 20.42,48.16 16,48.16 IC2.1 15.85,48.16 15.85,54.1 13.56,56.39 5.18,56.39
  Top 0.152: 5.18,56.39 3.5,54.71 C8.- 3.35,54.56 3.35,43.28 J1.3 3.35,43.13 3.35,41.3 6.25,38.41 J1.2 | J5.1 38.1,6.4 36.58,6.4 24.38,18.59 24.38,25.76 25.3,26.67 U$2.5
  Top 0.2: 20.27,81.53 20.27,83.36
  Bottom 0.152: ZX1.13 54.23,21.59 43.75,32.07 | 43.75,32.07 43.66,32.16 30.79,32.16 25.45,26.82 U$2.5 26.82,28.22 16.79,38.25 6.4,38.25 J1.2 | IC4.5 47.09,44.35 47.09,32.16 47,32.07 43.75,32.07 | 43.43,71.02 42.52,71.02 v41.91,70.41 | 43.43,71.02 v44.96,71.02 | 43.43,71.02 43.43,75.59 | 43.43,75.59 v43.43,76.2 43.31,76.07 | 43.43,75.59 v51.36,75.59 51.82,76.05 55.47,76.05 v56.54,74.98 | 31.55,84.63 31.55,91.44 30.33,92.66 IC4.27
  Bottom 0.4: 43.31,76.07 40.11,76.07 31.55,84.63
  pour Bottom: 0,0 0,97.54 1.27,98.81 71.63,98.81 72.14,98.3 72.14,0
  pour Top: 0.13,-0.13 0.13,98.93 0,99.06 72.01,99.06 72.39,98.68 72.39,0.89 71.5,0 0.25,0
LED
  Bottom 0.152: 57.15,16.46 ZX1.15
  Bottom 0.4: U$2.7 20.32,24.01 21.46,22.61 25.7,22.61 38.91,9.4 47.24,9.4 52.32,14.48 | 57.15,16.46 54.3,16.46 52.32,14.48 | 52.32,14.48 53.09,13.72 53.09,6.22 50.67,3.81 J5.10
MISO/12
  Top 0.152: 46.18,74.37 IC1.2 | 35.36,92.66 IC4.25
  Top 0.3: 46.18,74.37 44.02,74.37 39.29,79.1 38.41,79.1 35.36,82.14
  Top 0.4: 35.36,92.66 35.36,82.14
  Bottom 0.152: 67.21,67.36 J8.1 | 35.36,92.66 IC4.25
  Bottom 0.4: 67.21,67.36 67.21,70.76 57.66,80.31 46.94,80.31 35.36,91.9 35.36,92.66
MOSI/11
  Top 0.152: 46.18,75.13 IC1.1
  Top 0.4: IC4.24 38.1,92.46 38.1,89.79 41.02,86.87 41.78,86.87 44.58,84.07 44.58,75.69 45.14,75.13 46.18,75.13
  Bottom 0.3: 68.58,70.74 68.58,65.89 68.91,65.56 68.91,64.77 J8.4
  Bottom 0.4: 68.58,70.74 57.81,81.51 47.73,81.51 37.95,91.29 37.95,92.66 IC4.24
N$1
  Top 0.152: 37.64,77.42 C2.1 | 36.88,73.76 Y1.2
  Top 0.2: IC1.7 46.23,70.28 44.78,70.28 43.89,71.17 41,71.17 37.64,74.52
  Top 0.4: 37.64,77.42 37.64,74.52 36.88,73.76
N$2
  Top 0.152: 36.88,68.58 Y1.1
  Top 0.4: 36.88,68.58 37.05,68.42 | 37.05,68.42 37.52,67.94 37.52,65.02 C1.1 | IC1.8 45.29,69.52 43.81,69.11 42.52,67.82 37.64,67.82 37.05,68.42
N$3
  Top 0.152: 41.45,80.31 D1.2 | 39.34,80.31 R1.1
  Top 0.4: 41.45,80.31 39.34,80.31
N$4
  Top 0.152: 29.57,77.57 C15.1 | 30.48,81.23 Y2.1 | 24.94,82.19 24.84,82.3 U$1.7
  Top 0.4: 29.57,80.31 29.57,77.57 | 30.48,81.23 29.57,80.31 | 24.94,82.19 24.94,80.77 25.4,80.31 29.57,80.31
N$5
  Top 0.152: 29.57,90.07 C16.1 | 30.48,86.41 Y2.2 30.18,86.72 30.18,86.56 | 26.06,82.45 U$1.8
  Top 0.4: 29.57,90.07 29.57,87.33 30.18,86.72 30.48,86.41 | 30.18,86.56 26.06,82.45
N$6
  Top 0.152: 15.51,68.63 R8.2
  Top 0.4: D8.2 17.78,70.03 16.38,68.63 15.51,68.63
N$7
  Top 0.152: 12.65,80.16 D5.A | 9.6,85.04 X1.VBUS
  Top 0.8: 12.65,80.16 12.65,81.99 9.6,85.04
N$8
  Top 0.152: 20.73,88.09 20.88,87.94 U$1.13 | 20.73,91.44 C19.1
  Top 0.4: 20.73,88.09 20.73,91.44
N$9
  Top 0.152: 22.4,71.32 22.86,70.87 R7.1 | 20.42,71.32 D7.2
  Top 0.4: 22.4,71.32 20.42,71.32
N$10
  Top 0.152: U$1.4 20.95,81.84
  Top 0.3: C20.1 22.86,79.93 20.95,81.84
N$11
  Top 0.152: 17.83,29.41 R9.2 | 17.83,26.82 U$2.8
  Top 0.4: 17.83,26.82 17.83,29.41
  Bottom 0.152: 40.59,1.17 40.49,1.27 | 15.75,26.8 15.62,26.67
  Bottom 0.4: J5.4 40.49,3.66 40.49,1.27 30.73,1.27 15.62,16.38 15.62,26.67 | 40.59,1.17 52.58,1.17 57.15,5.74 ZX1.16 | U$2.8 15.75,26.8
N$24
  Top 0.152: 16,43.28 IC2.3 | 16,39.47 D2.C
  Top 0.8: 16,39.47 16,43.28
  Top 1: C8.+ 6.22,48.99 6.22,40.77 6.86,40.13 9.65,40.13 9.65,35.81 14.35,35.81 15.99,37.46 D2.C
N$44
  Top 0.152: R3.1 23.16,59.74 20.57,59.74 D3.1
N$45
  Top 0.152: 12.65,40.08 12.04,39.47 D2.A | 12.65,43.28 F1.1
  Top 1: 12.65,40.08 12.65,43.28
N$46
  Top 0.152: R4.1 23.32,64.77 23.32,61.42 24.08,60.66 24.08,55.78 25.15,54.71 D4.1
RESET  (via drill 0.35)
  Top 0.152: 39.62,54.56 R2.1 | 37.03,54.56 S2.2 36.88,54.56 | 22.55,91.44 C19.2 | v38.63,74.95 40.74,72.85 46.18,72.85 IC1.4
  Top 0.4: 37.03,54.56 39.62,54.56 | v24.84,89.15 22.55,91.44 | v34.75,52.43 36.88,54.56
  Bottom 0.152: 36.73,44.5 IC4.1 | 31.7,49.53 31.85,49.53
  Bottom 0.4: 24.84,74.95 24.84,56.39 31.7,49.53 36.73,44.5 | 24.84,74.95 v24.84,89.15 | 24.84,74.95 v38.63,74.95 38.63,68.12 48.23,58.52 63.6,58.52 J8.5 | 31.85,49.53 v34.75,52.43
RX
  Top 0.152: 20.27,78.49 R5.1 | 19.81,82.3 U$1.3
  Top 0.3: 20.27,78.49 20.27,79.93 19.81,80.39 19.81,82.3
RXD0/0  (via drill 0.35)
  Top 0.152: 17.83,73.46 D8.1 17.83,73.3 | 17.83,76.5 R6.2 17.96,76.33 | 46.33,68.58 IC1.9
  Top 0.18: 20.27,69.8 23.9,69.8
  Top 0.3: 46.33,68.58 47.45,68.58 47.65,68.38 47.65,66.78 43.76,62.89 30.81,62.89 23.9,69.8 | 20.27,69.8 19,71.07 19,72.14 17.83,73.3
  Top 0.4: 17.83,76.5 17.83,73.46 | 17.96,76.33 v19.05,77.42
  Bottom 0.4: v19.05,77.42 19.05,92.48 23.27,96.7 65.81,96.7 67.31,95.19 IC4.13
S0
  Top 0.152: 17.78,17.89 17.76,17.9 | 48.31,6.4 J5.9
  Top 0.2: 46.69,4.78 30.89,4.78
  Top 0.4: 30.89,4.78 17.76,17.9 | J5.9 46.69,4.78 | 17.78,17.89 U$2.1 | 48.31,6.4 56.19,6.4 58.32,8.53 64.77,8.53 ZX1.1
S1
  Top 0.152: 64.77,16.46 ZX1.2 | 45.72,6.4 J5.7
  Top 0.4: 64.77,16.46 63.5,16.46 55.24,8.2 47.52,8.2 45.72,6.4
  Bottom 0.152: 21.38,17.87 21.37,17.87 | 45.72,6.4 J5.7
  Bottom 0.4: 21.37,17.87 31.29,7.95 44.17,7.95 45.72,6.4 | 21.38,17.87 U$2.2
S3
  Top 0.152: 28.04,18.9 27.94,18.9 | 25.45,18.9 U$2.4 | 40.28,18.9 40.64,18.54
  Top 0.4: 27.94,18.9 25.45,18.9 | J5.3 40.64,18.54 40.64,24.77 51.82,35.94 58.55,35.94 61.47,33.02 61.47,21.34 64.52,21.34 ZX1.4 | 28.04,18.9 40.28,18.9
SCK/13  (via drill 0.35)
  Top 0.152: 46.18,73.61 IC1.3 | 39.32,82.33 R1.2
  Top 0.4: 46.18,73.61 43.74,73.61 v39.12,78.23 | 39.32,82.33 39.32,83.06 v38.86,83.52
  Bottom 0.4: IC4.26 32.77,91.01 38.86,84.91 v38.86,83.52 39.12,83.26 v39.12,78.23 58.14,78.23 65.25,71.12 65.25,65.23 65.71,64.77 J8.3
SS/10
  Top 0.152: 47.75,77.13 IC1.44
  Top 0.4: 47.75,77.13 47.75,84.78 40.39,92.15 IC4.23
TCK/24
  Top 0.152: 26.82,58.95 26.82,52.96
  Top 0.2: IC1.21 55.3,65.29
  Top 0.3: 26.82,58.95 29.39,61.52 48.72,61.52 50.62,63.42 54.74,63.42 55.3,63.98 55.3,65.29
  Top 0.4: 26.82,52.96 25.02,51.16 25.02,38.67 R9.1
TMS/25
  Top 0.152: 43.13,6.25 J5.5 | 56.06,65.31 IC1.22
  Top 0.2: 42.22,5.33 33.25,5.33
  Top 0.3: 43.13,6.25 42.22,5.33 | 56.06,65.31 56.06,62.71 55.19,61.85 52.68,61.85 52.25,61.42 52.25,39.65 52.78,39.12 67.31,39.12 67.31,19.05
  Top 0.4: 33.25,5.33 22.86,15.72 U$2.3 | 67.31,19.05 ZX1.3 59.82,19.05 59.82,33.27 59.05,34.04 52.96,34.04 43.18,24.26 J5.5
TX
  Top 0.152: 17.83,78.49 R6.1
  Top 0.3: 17.83,78.49 17.83,80.44 18.41,81.03 U$1.2
TXD0/1
  Top 0.152: 20.42,73.46 D7.1 20.42,73.3 | 20.42,76.5 R5.2 | 27.32,70.75 27.25,70.81 27.13,70.69 | 46.18,67.82 IC1.10
  Top 0.3: 46.18,67.82 44.88,67.82 40.51,63.45 34.37,63.45 27.13,70.69
  Top 0.4: 20.42,76.5 20.42,73.46 | 27.25,70.81 24.77,73.3 20.42,73.3 | IC4.14 64.77,95.66 64.62,95.81 34.44,95.81 34.09,95.45 34.09,77.52 27.32,70.75
VIN
  Top 0.152: 12.65,45.41 F1.2 | 9.6,43.28 J1.1
  Top 1: 12.65,45.41 11.73,45.41 9.6,43.28
  Bottom 0.152: IC4.6 49.53,46.23 48.28,47.47 38.76,47.47 37.95,46.66 37.95,43.28 35.94,41.27 | 9.6,43.13 J1.1
  Bottom 1: 35.94,41.27 11.46,41.27 9.6,43.13

### Text on the board
tNames: 9 | 6 | 4 | 3 | 2 | RXD1 | TXD0 | A5REF | GND | 13 | 12 | 11 | 10 | 8 | 7 | 5 | A0 | A1 | A2 | +5V | A3 | A4 | A5 | +3V3 | GND | GND | +VIN | RESET | EAGLE | KEELOQ PROGRAMMER | HCS 200-300/1-320-360/1